# EAGLE design board (EAGLE 9.6.2)

## Sheet 1 of 5: Power
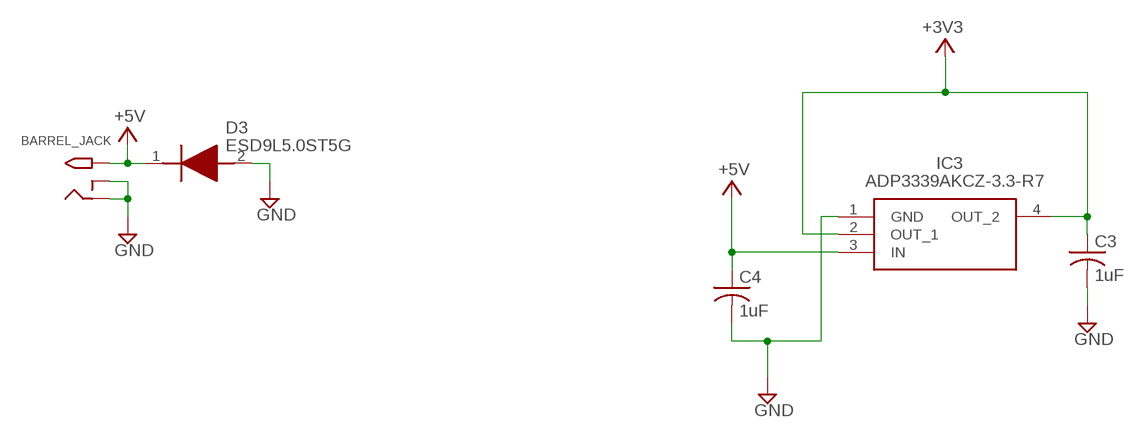
[diagram p0: schematic, sheet 1]

### Parts
BARREL_JACK  2.1MMJACKTHM  [PJ-102A]
C3  1uF  C-USC0402  [C0402]
C4  1uF  C-USC0402  [C0402]
D3  ESD9L5.0ST5G  [SODFL1006X40N]
IC3  ADP3339AKCZ-3.3-R7  [SOT230P700X180-4N]

### Nets
+3V3: C3.1 IC3.2(OUT_1) IC3.4(OUT_2) ; also sheet 3,5
+5V: BARREL_JACK.TIP C4.1 D3.1(K) IC3.3(IN) ; also sheet 3,4
GND: BARREL_JACK.RING BARREL_JACK.RING_SW C3.2 C4.2 D3.2(A) IC3.1(GND) ; also sheet 2,3,4,5

## Sheet 2 of 5: USB
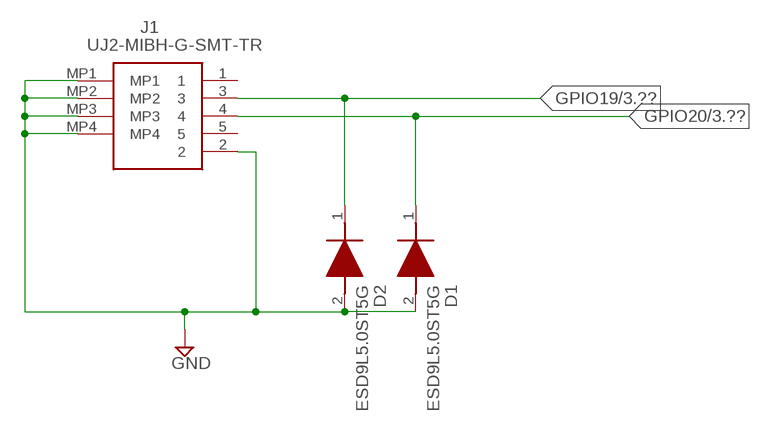
[diagram p1: schematic, sheet 2]

### Parts
D1  ESD9L5.0ST5G  [SODFL1006X40N]
D2  ESD9L5.0ST5G  [SODFL1006X40N]
J1  UJ2-MIBH-G-SMT-TR  [UJ2MIBHGSMTTR]

### Nets
GND: D1.2(A) D2.2(A) J1.2 J1.MP1 J1.MP2 J1.MP3 J1.MP4 ; also sheet 1,3,4,5
GPIO19: D2.1(K) J1.3 ; also sheet 3
GPIO20: D1.1(K) J1.4 ; also sheet 3
Unconnected: J1.1 J1.5

## Sheet 3 of 5: Controller
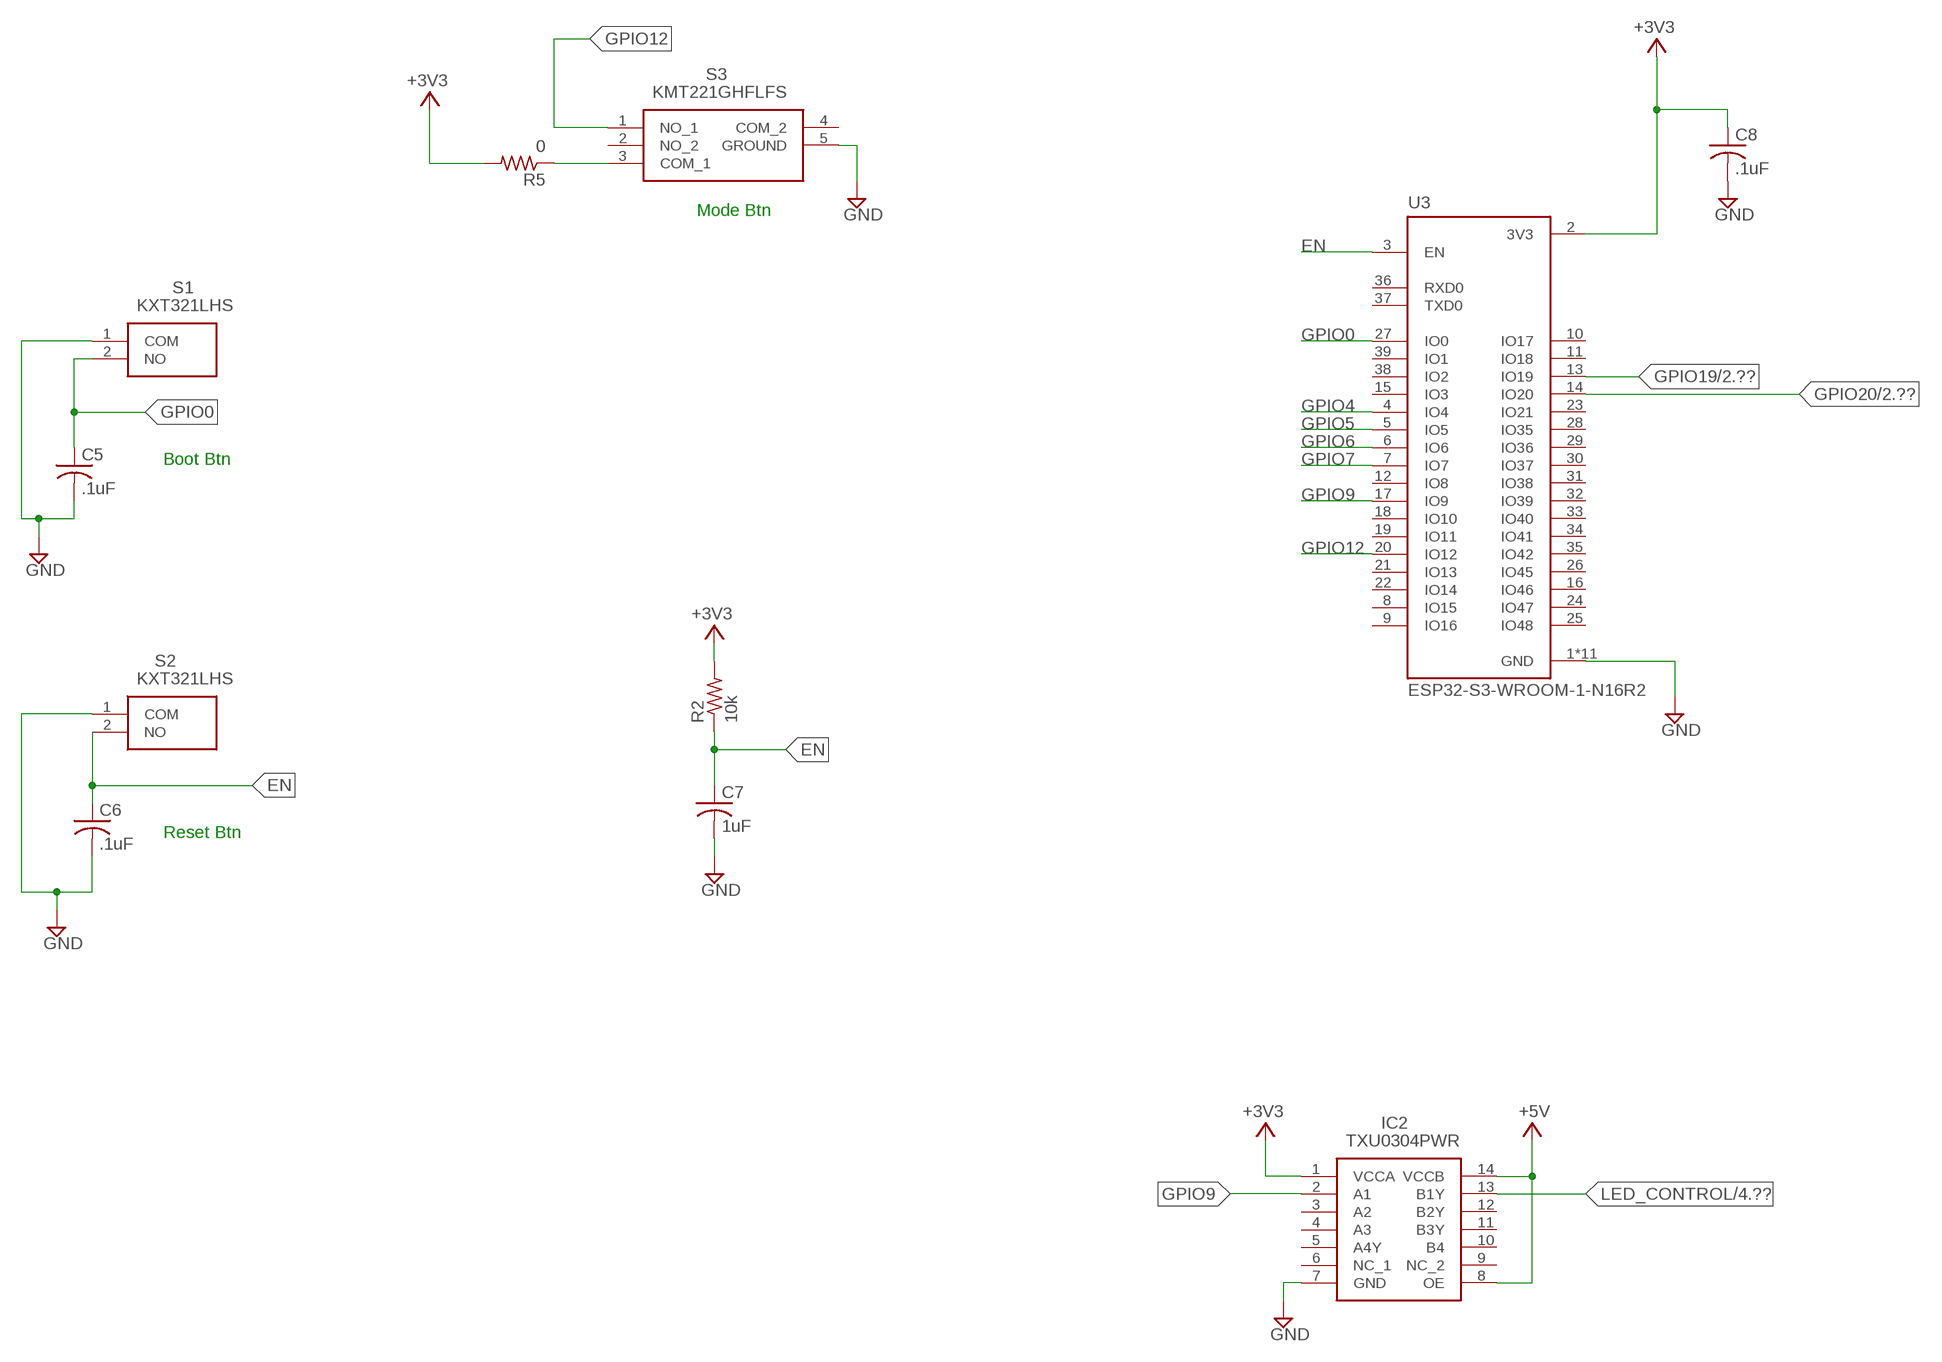
[diagram p2: schematic, sheet 3]

### Parts
C5  .1uF  C-USC0402  [C0402]
C6  .1uF  C-USC0402  [C0402]
C7  1uF  C-USC0402  [C0402]
C8  .1uF  C-USC0402  [C0402]
IC2  TXU0304PWR  [SOP65P640X120-14N]
R2  10k  R-US_R0402  [R0402]
R5  0  R-US_R0402  [R0402]
S1  KXT321LHS  [KXT321LHS]
S2  KXT321LHS  [KXT321LHS]
S3  KMT221GHFLFS  [KMT221GHFLFS]
U3  ESP32-S3-WROOM-1-N16R2  [XCVR_ESP32-S3-WROOM-1-N16R2]

### Nets
+3V3: C8.1 IC2.1(VCCA) R2.2 R5.2 U3.2(3V3) ; also sheet 1,5
+5V: IC2.8(OE) IC2.14(VCCB) ; also sheet 1,4
EN: C6.1 C7.1 R2.1 S2.2(NO) U3.3(EN)
GND: C5.2 C6.2 C7.2 C8.2 IC2.7(GND) S1.1(COM) S2.1(COM) S3.5(GROUND) U3.1(GND) U3.40(GND) U3.41_1(GND) U3.41_2(GND) U3.41_3(GND) U3.41_4(GND) U3.41_5(GND) U3.41_6(GND) U3.41_7(GND) U3.41_8(GND) U3.41_9(GND) ; also sheet 1,2,4,5
GPIO0: C5.1 S1.2(NO) U3.27(IO0)
GPIO4: U3.4(IO4) ; also sheet 5
GPIO5: U3.5(IO5) ; also sheet 5
GPIO6: U3.6(IO6) ; also sheet 5
GPIO7: U3.7(IO7) ; also sheet 5
GPIO9: IC2.2(A1) U3.17(IO9)
GPIO12: S3.1(NO_1) U3.20(IO12)
GPIO19: U3.13(IO19) ; also sheet 2
GPIO20: U3.14(IO20) ; also sheet 2
LED_CONTROL: IC2.13(B1Y) ; also sheet 4
N$16: R5.1 S3.3(COM_1)
Unconnected: IC2.3(A2) IC2.4(A3) IC2.5(A4Y) IC2.6(NC_1) IC2.9(NC_2) IC2.10(B4) IC2.11(B3Y) IC2.12(B2Y) S3.2(NO_2) S3.4(COM_2) U3.8(IO15) U3.9(IO16) U3.10(IO17) U3.11(IO18) U3.12(IO8) U3.15(IO3) U3.16(IO46) U3.18(IO10) U3.19(IO11) U3.21(IO13) U3.22(IO14) U3.23(IO21) U3.24(IO47) U3.25(IO48) U3.26(IO45) U3.28(IO35) U3.29(IO36) U3.30(IO37) U3.31(IO38) U3.32(IO39) U3.33(IO40) U3.34(IO41) U3.35(IO42) U3.36(RXD0) U3.37(TXD0) U3.38(IO2) U3.39(IO1)

### Notes on the sheet
- Mode Btn
- Boot Btn
- Reset Btn

## Sheet 4 of 5: LEDs
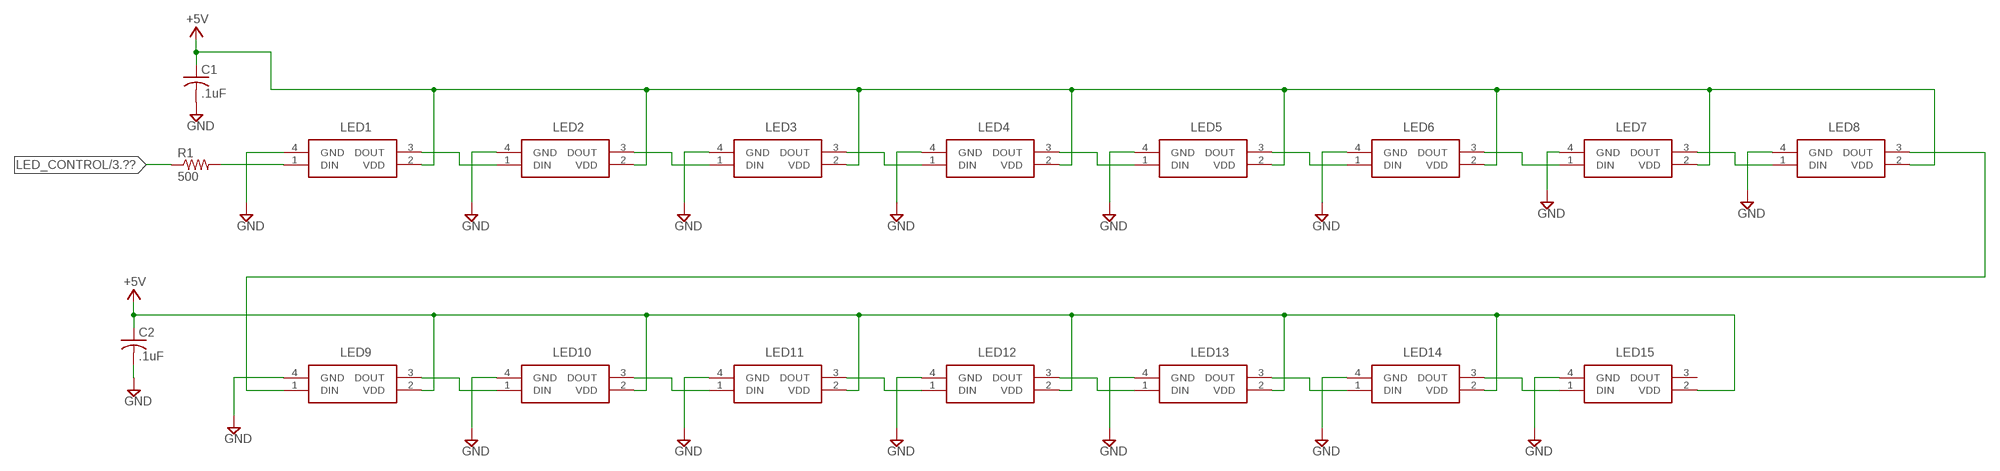
[diagram p3: schematic, sheet 4]

### Parts
C1  .1uF  C-USC0402  [C0402]
C2  .1uF  C-USC0402  [C0402]
LED1  4492__SK6805-EC_15_  [4492SK6805EC15]
LED2  4492__SK6805-EC_15_  [4492SK6805EC15]
LED3  4492__SK6805-EC_15_  [4492SK6805EC15]
LED4  4492__SK6805-EC_15_  [4492SK6805EC15]
LED5  4492__SK6805-EC_15_  [4492SK6805EC15]
LED6  4492__SK6805-EC_15_  [4492SK6805EC15]
LED7  4492__SK6805-EC_15_  [4492SK6805EC15]
LED8  4492__SK6805-EC_15_  [4492SK6805EC15]
LED9  4492__SK6805-EC_15_  [4492SK6805EC15]
LED10  4492__SK6805-EC_15_  [4492SK6805EC15]
LED11  4492__SK6805-EC_15_  [4492SK6805EC15]
LED12  4492__SK6805-EC_15_  [4492SK6805EC15]
LED13  4492__SK6805-EC_15_  [4492SK6805EC15]
LED14  4492__SK6805-EC_15_  [4492SK6805EC15]
LED15  4492__SK6805-EC_15_  [4492SK6805EC15]
R1  500  R-US_R0402  [R0402]

### Nets
+5V: C1.1 C2.1 LED1.2(VDD) LED2.2(VDD) LED3.2(VDD) LED4.2(VDD) LED5.2(VDD) LED6.2(VDD) LED7.2(VDD) LED8.2(VDD) LED9.2(VDD) LED10.2(VDD) LED11.2(VDD) LED12.2(VDD) LED13.2(VDD) LED14.2(VDD) LED15.2(VDD) ; also sheet 1,3
GND: C1.2 C2.2 LED1.4(GND) LED2.4(GND) LED3.4(GND) LED4.4(GND) LED5.4(GND) LED6.4(GND) LED7.4(GND) LED8.4(GND) LED9.4(GND) LED10.4(GND) LED11.4(GND) LED12.4(GND) LED13.4(GND) LED14.4(GND) LED15.4(GND) ; also sheet 1,2,3,5
LED_CONTROL: R1.1 ; also sheet 3
N$1: LED1.3(DOUT) LED2.1(DIN)
N$2: LED2.3(DOUT) LED3.1(DIN)
N$3: LED3.3(DOUT) LED4.1(DIN)
N$4: LED4.3(DOUT) LED5.1(DIN)
N$5: LED5.3(DOUT) LED6.1(DIN)
N$6: LED6.3(DOUT) LED7.1(DIN)
N$7: LED7.3(DOUT) LED8.1(DIN)
N$8: LED8.3(DOUT) LED9.1(DIN)
N$9: LED9.3(DOUT) LED10.1(DIN)
N$10: LED10.3(DOUT) LED11.1(DIN)
N$11: LED11.3(DOUT) LED12.1(DIN)
N$12: LED12.3(DOUT) LED13.1(DIN)
N$13: LED13.3(DOUT) LED14.1(DIN)
N$14: LED14.3(DOUT) LED15.1(DIN)
N$15: LED1.1(DIN) R1.2
Unconnected: LED15.3(DOUT)

## Sheet 5 of 5: 7-segment
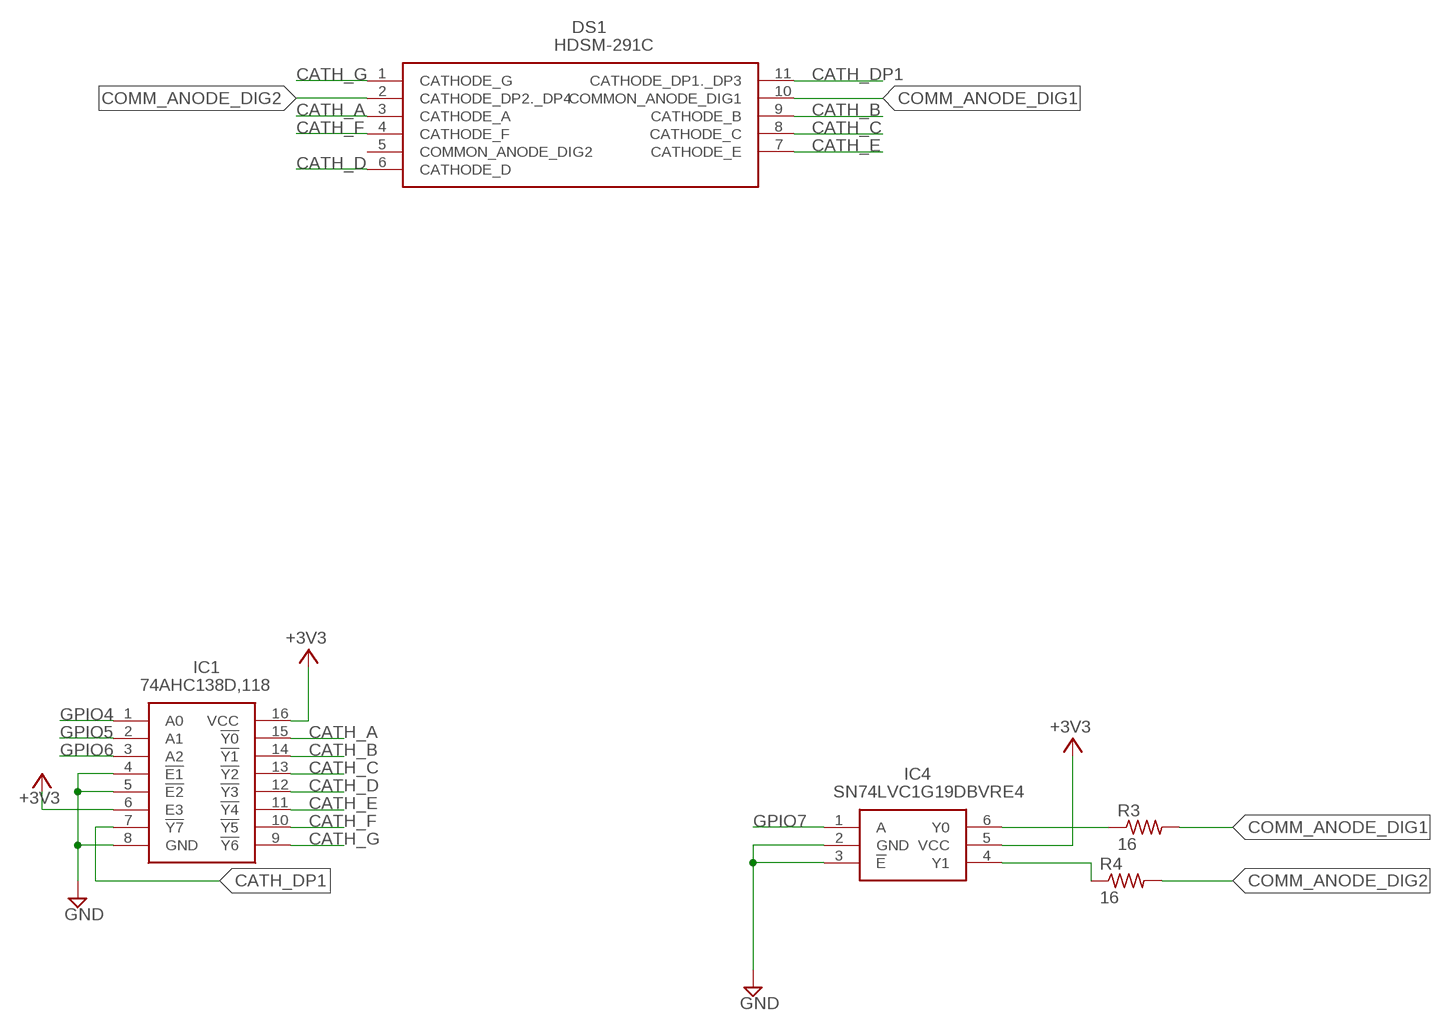
[diagram p4: schematic, sheet 5]

### Parts
DS1  HDSM-291C  [HDSM291C]
IC1  74AHC138D,118  [SOIC127P600X175-16N]
IC4  SN74LVC1G19DBVRE4  [SOT95P280X145-6N]
R3  16  R-US_R0402  [R0402]
R4  16  R-US_R0402  [R0402]

### Nets
+3V3: IC1.6(E3) IC1.16(VCC) IC4.5(VCC) ; also sheet 1,3
CATH_A: DS1.3(CATHODE_A) IC1.15(!Y0)
CATH_B: DS1.9(CATHODE_B) IC1.14(!Y1)
CATH_C: DS1.8(CATHODE_C) IC1.13(!Y2)
CATH_D: DS1.6(CATHODE_D) IC1.12(!Y3)
CATH_DP1: DS1.11(CATHODE_DP1._DP3) IC1.7(!Y7)
CATH_E: DS1.7(CATHODE_E) IC1.11(!Y4)
CATH_F: DS1.4(CATHODE_F) IC1.10(!Y5)
CATH_G: DS1.1(CATHODE_G) IC1.9(!Y6)
COMM_ANODE_DIG1: DS1.10(COMMON_ANODE_DIG1) R3.2
COMM_ANODE_DIG2: DS1.2(CATHODE_DP2._DP4) R4.2
GND: IC1.4(!E1) IC1.5(!E2) IC1.8(GND) IC4.2(GND) IC4.3(!E) ; also sheet 1,2,3,4
GPIO4: IC1.1(A0) ; also sheet 3
GPIO5: IC1.2(A1) ; also sheet 3
GPIO6: IC1.3(A2) ; also sheet 3
GPIO7: IC4.1(A) ; also sheet 3
N$19: IC4.6(Y0) R3.1
N$25: IC4.4(Y1) R4.1
Unconnected: DS1.5(COMMON_ANODE_DIG2)

## Library data of the parts
BARREL_JACK = adafruit:2.1MMJACK: 2.1mm x 5.5mm THM DC jack with internal switch. Digikey part #PJ-102A, 4UCON part #05537 2.1mm x 5.5mm SMT DC jack with internal switch. Digikey part #PJ-002A-SMT, 4UCON part #03267 By microbuilder.eu & adafruit.com
C1-C8 = adafruit:C-US: CAPACITOR, American symbol
D1-D3 = SamacSys_Parts:ESD9L5.0ST5G: Transient Voltage Suppressors ESD Protection Diodes with UltraLow Capacitance Source: Datasheet <http://www.onsemi.com/pub/Collateral/ESD9L-D.PDF>; DESCRIPTION: Transient Voltage Suppressors ESD Protection Diodes with UltraLow Capacitance; HEIGHT: 0.4mm; MANUFACTURER_NAME: onsemi; MANUFACTURER_PART_NUMBER: ESD9L5.0ST5G; MOUSER_PART_NUMBER: 863-ESD9L5.0ST5G; MOUSER_PRICE-STOCK: https://www.mouser.co.uk/ProductDetail/onsemi/ESD9L5.0ST5G?qs=lq5%252BOP7PS0%252BtbEEODUxZiA%3D%3D
DS1 = SamacSys_Parts:HDSM-291C: BROADCOM LIMITED - HDSM-291C - LED DISPLAY, SMD, DUAL, 7MM, RED, CA Source: Datasheet <https://www.mouser.co.uk/datasheet/2/678/AV02-0981EN_DS_HDSM-29xx_2019-04-18-1827889.pdf>; DESCRIPTION: BROADCOM LIMITED - HDSM-291C - LED DISPLAY, SMD, DUAL, 7MM, RED, CA; HEIGHT: 3.75mm; MANUFACTURER_NAME: Avago Technologies; MANUFACTURER_PART_NUMBER: HDSM-291C; MOUSER_PART_NUMBER: 630-HDSM-291C; MOUSER_PRICE-STOCK: https://www.mouser.co.uk/ProductDetail/Broadcom-Avago/HDSM-291C?qs=NCV3C3qdz%2FCIP43YVdyTXA%3D%3D
IC1 = SamacSys_Parts:74AHC138D,118: 74AHC(T)138 - 3-to-8 line decoder/demultiplexer; inverting@en-us Source: Datasheet <https://assets.nexperia.com/documents/data-sheet/74AHC_AHCT138.pdf>; DESCRIPTION: 74AHC(T)138 - 3-to-8 line decoder/demultiplexer; inverting@en-us; HEIGHT: 1.75mm; MANUFACTURER_NAME: Nexperia; MANUFACTURER_PART_NUMBER: 74AHC138D,118; MOUSER_PART_NUMBER: 771-74AHC138D-T; MOUSER_PRICE-STOCK: https://www.mouser.co.uk/ProductDetail/Nexperia/74AHC138D118?qs=P62ublwmbi%252BfNK%252BP%2F9EeQw%3D%3D
IC2 = SamacSys_Parts:TXU0304PWR: Translation - Voltage Levels Four channel unidirectional level shifter Source: Datasheet <https://www.ti.com/lit/ds/symlink/txu0304.pdf?ts=1627717511667&ref_url=https%3A%2F%2Fwww.ti.com%2Fproduct%2FTXU0304>; DESCRIPTION: Translation - Voltage Levels Four channel unidirectional level shifter; HEIGHT: 1.2mm; MANUFACTURER_NAME: Texas Instruments; MANUFACTURER_PART_NUMBER: TXU0304PWR; MOUSER_PART_NUMBER: 595-TXU0304PWR; MOUSER_PRICE-STOCK: https://www.mouser.co.uk/ProductDetail/Texas-Instruments/TXU0304PWR?qs=QNEnbhJQKvZVYXIKZoXs0A%3D%3D
IC3 = SamacSys_Parts:ADP3339AKCZ-3.3-R7: ADP3339AKCZ-3.3-R7, Low Dropout Voltage Regulator, 1.5A, 3.3 V +/-0.9%, 2.8 6 Vin, 4-Pin SOT-223 Source: Datasheet <http://www.analog.com/static/imported-files/data_sheets/ADP3339.pdf>; DESCRIPTION: ADP3339AKCZ-3.3-R7, Low Dropout Voltage Regulator, 1.5A, 3.3 V +/-0.9%, 2.8 6 Vin, 4-Pin SOT-223; HEIGHT: 1.8mm; MANUFACTURER_NAME: Analog Devices; MANUFACTURER_PART_NUMBER: ADP3339AKCZ-3.3-R7; MOUSER_PART_NUMBER: 584-ADP3339AKCZ3.3R7; MOUSER_PRICE-STOCK: https://www.mouser.co.uk/ProductDetail/Analog-Devices/ADP3339AKCZ-3.3-R7?qs=WIvQP4zGanhoxUECVzDnsA%3D%3D
IC4 = SamacSys_Parts:SN74LVC1G19DBVRE4: Encoders, Decoders, Multiplexers & Demultiplexers 1 of 2 Decoder Demultiplexer Source: Datasheet <https://www.ti.com/lit/gpn/SN74LVC1G19>; DESCRIPTION: Encoders, Decoders, Multiplexers & Demultiplexers 1 of 2 Decoder Demultiplexer; HEIGHT: 1.45mm; MANUFACTURER_NAME: Texas Instruments; MANUFACTURER_PART_NUMBER: SN74LVC1G19DBVRE4; MOUSER_PART_NUMBER: 595-74LVC1G19DBVRE4; MOUSER_PRICE-STOCK: https://www.mouser.co.uk/ProductDetail/Texas-Instruments/SN74LVC1G19DBVRE4?qs=pajgIaoyDUhZzpoVmzDWwA%3D%3D
J1 = SamacSys_Parts:UJ2-MIBH-G-SMT-TR: USB Connectors Source: Datasheet; DESCRIPTION: USB Connectors; HEIGHT: 3.15mm; MANUFACTURER_NAME: CUI Inc.; MANUFACTURER_PART_NUMBER: UJ2-MIBH-G-SMT-TR; MOUSER_PART_NUMBER: 490-UJ2-MIBH-G-SMTTR; MOUSER_PRICE-STOCK: https://www.mouser.co.uk/ProductDetail/CUI-Devices/UJ2-MIBH-G-SMT-TR?qs=IS%252B4QmGtzzpvS1XQusp0iA%3D%3D
LED1-LED15 = SamacSys_Parts:4492__SK6805-EC_15_: Addressable Lighting series 10 LED Discrete - Red, Green, Blue (RGB) 1.50mm L x 1.50mm W Source: Datasheet <https://cdn-shop.adafruit.com/product-files/4492/Datasheet.pdf>; DESCRIPTION: Addressable Lighting series 10 LED Discrete - Red, Green, Blue (RGB) 1.50mm L x 1.50mm W; HEIGHT: 0.75mm; MANUFACTURER_NAME: Adafruit; MANUFACTURER_PART_NUMBER: 4492 (SK6805-EC 15)
R1-R5 = adafruit:R-US_: RESISTOR, American symbol
S1 S2 = SamacSys_Parts:KXT321LHS: Tactile Switches 20mA 15VDC 160gf 0.6mm SPST NO SMT Source: Datasheet <https://www.arrow.com/en/products/kxt321lhs/ck>; DESCRIPTION: Tactile Switches 20mA 15VDC 160gf 0.6mm SPST NO SMT; HEIGHT: 0.7mm; MANUFACTURER_NAME: C & K COMPONENTS; MANUFACTURER_PART_NUMBER: KXT321LHS; MOUSER_PART_NUMBER: 611-KXT321LHS; MOUSER_PRICE-STOCK: https://www.mouser.co.uk/ProductDetail/CK/KXT321LHS?qs=%2FQ2qp2Z%2FWFztp%2FMwKtSHuA%3D%3D
S3 = SamacSys_Parts:KMT221GHFLFS: Tactile Switches SPST-NO, Off-Mom,SMT Tact Source: Datasheet <https://www.arrow.com/en/products/kmt221ghflfs/ck>; DESCRIPTION: Tactile Switches SPST-NO, Off-Mom,SMT Tact; HEIGHT: 0.82mm; MANUFACTURER_NAME: C & K COMPONENTS; MANUFACTURER_PART_NUMBER: KMT221GHFLFS; MOUSER_PART_NUMBER: 611-KMT221GHFLFS; MOUSER_PRICE-STOCK: https://www.mouser.co.uk/ProductDetail/CK/KMT221GHFLFS?qs=qoLfgwe54911fWMAni3k4g%3D%3D
U3 = ESP32-S3-WROOM-1-N16R2:ESP32-S3-WROOM-1-N16R2: Check availability <https://pricing.snapeda.com/parts/ESP32-S3-WROOM-1-N16R2/Espressif%20Systems/view-part?ref=eda>; AVAILABILITY: In Stock; DESCRIPTION: Bluetooth, WiFi 802.11b/g/n, Bluetooth v5.0 Transceiver Module 2.4GHz PCB Trace Surface Mount; MF: Espressif Systems; MP: ESP32-S3-WROOM-1-N16R2; PACKAGE: None; PRICE: None; PURCHASE-URL: https://pricing.snapeda.com/search/part/ESP32-S3-WROOM-1-N16R2/?ref=eda

## Net classes
1 diff pair: width 0.17 mm, clearance 0.22 mm to class 0, clearance 0.203 mm

## Board
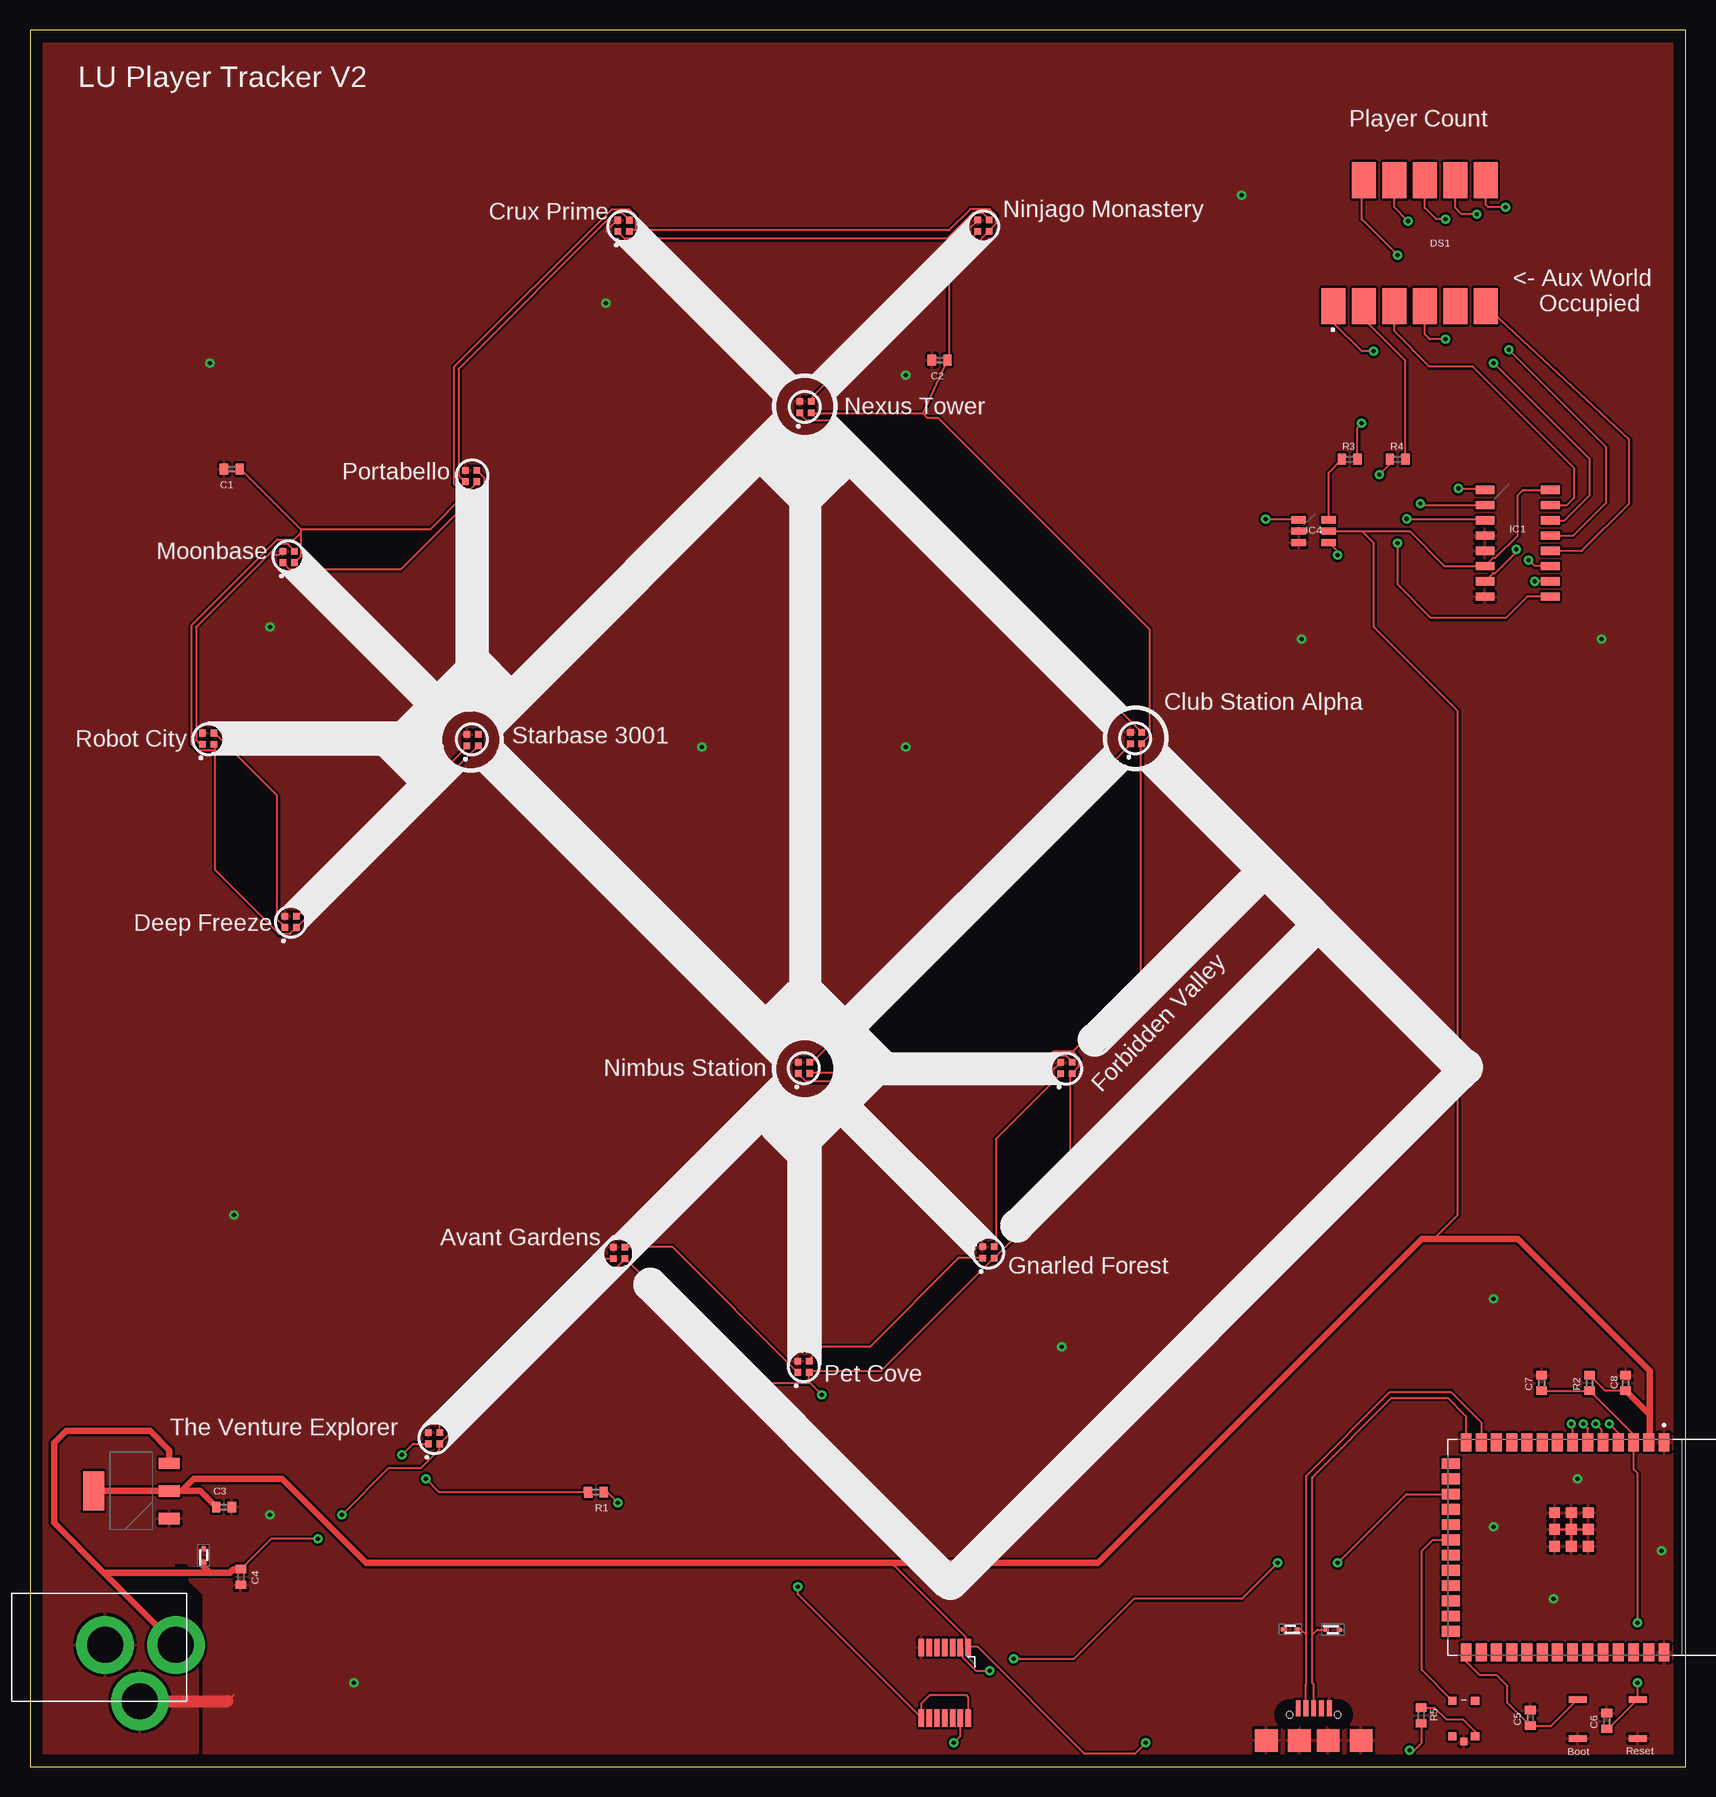
[diagram p5: board, top side]
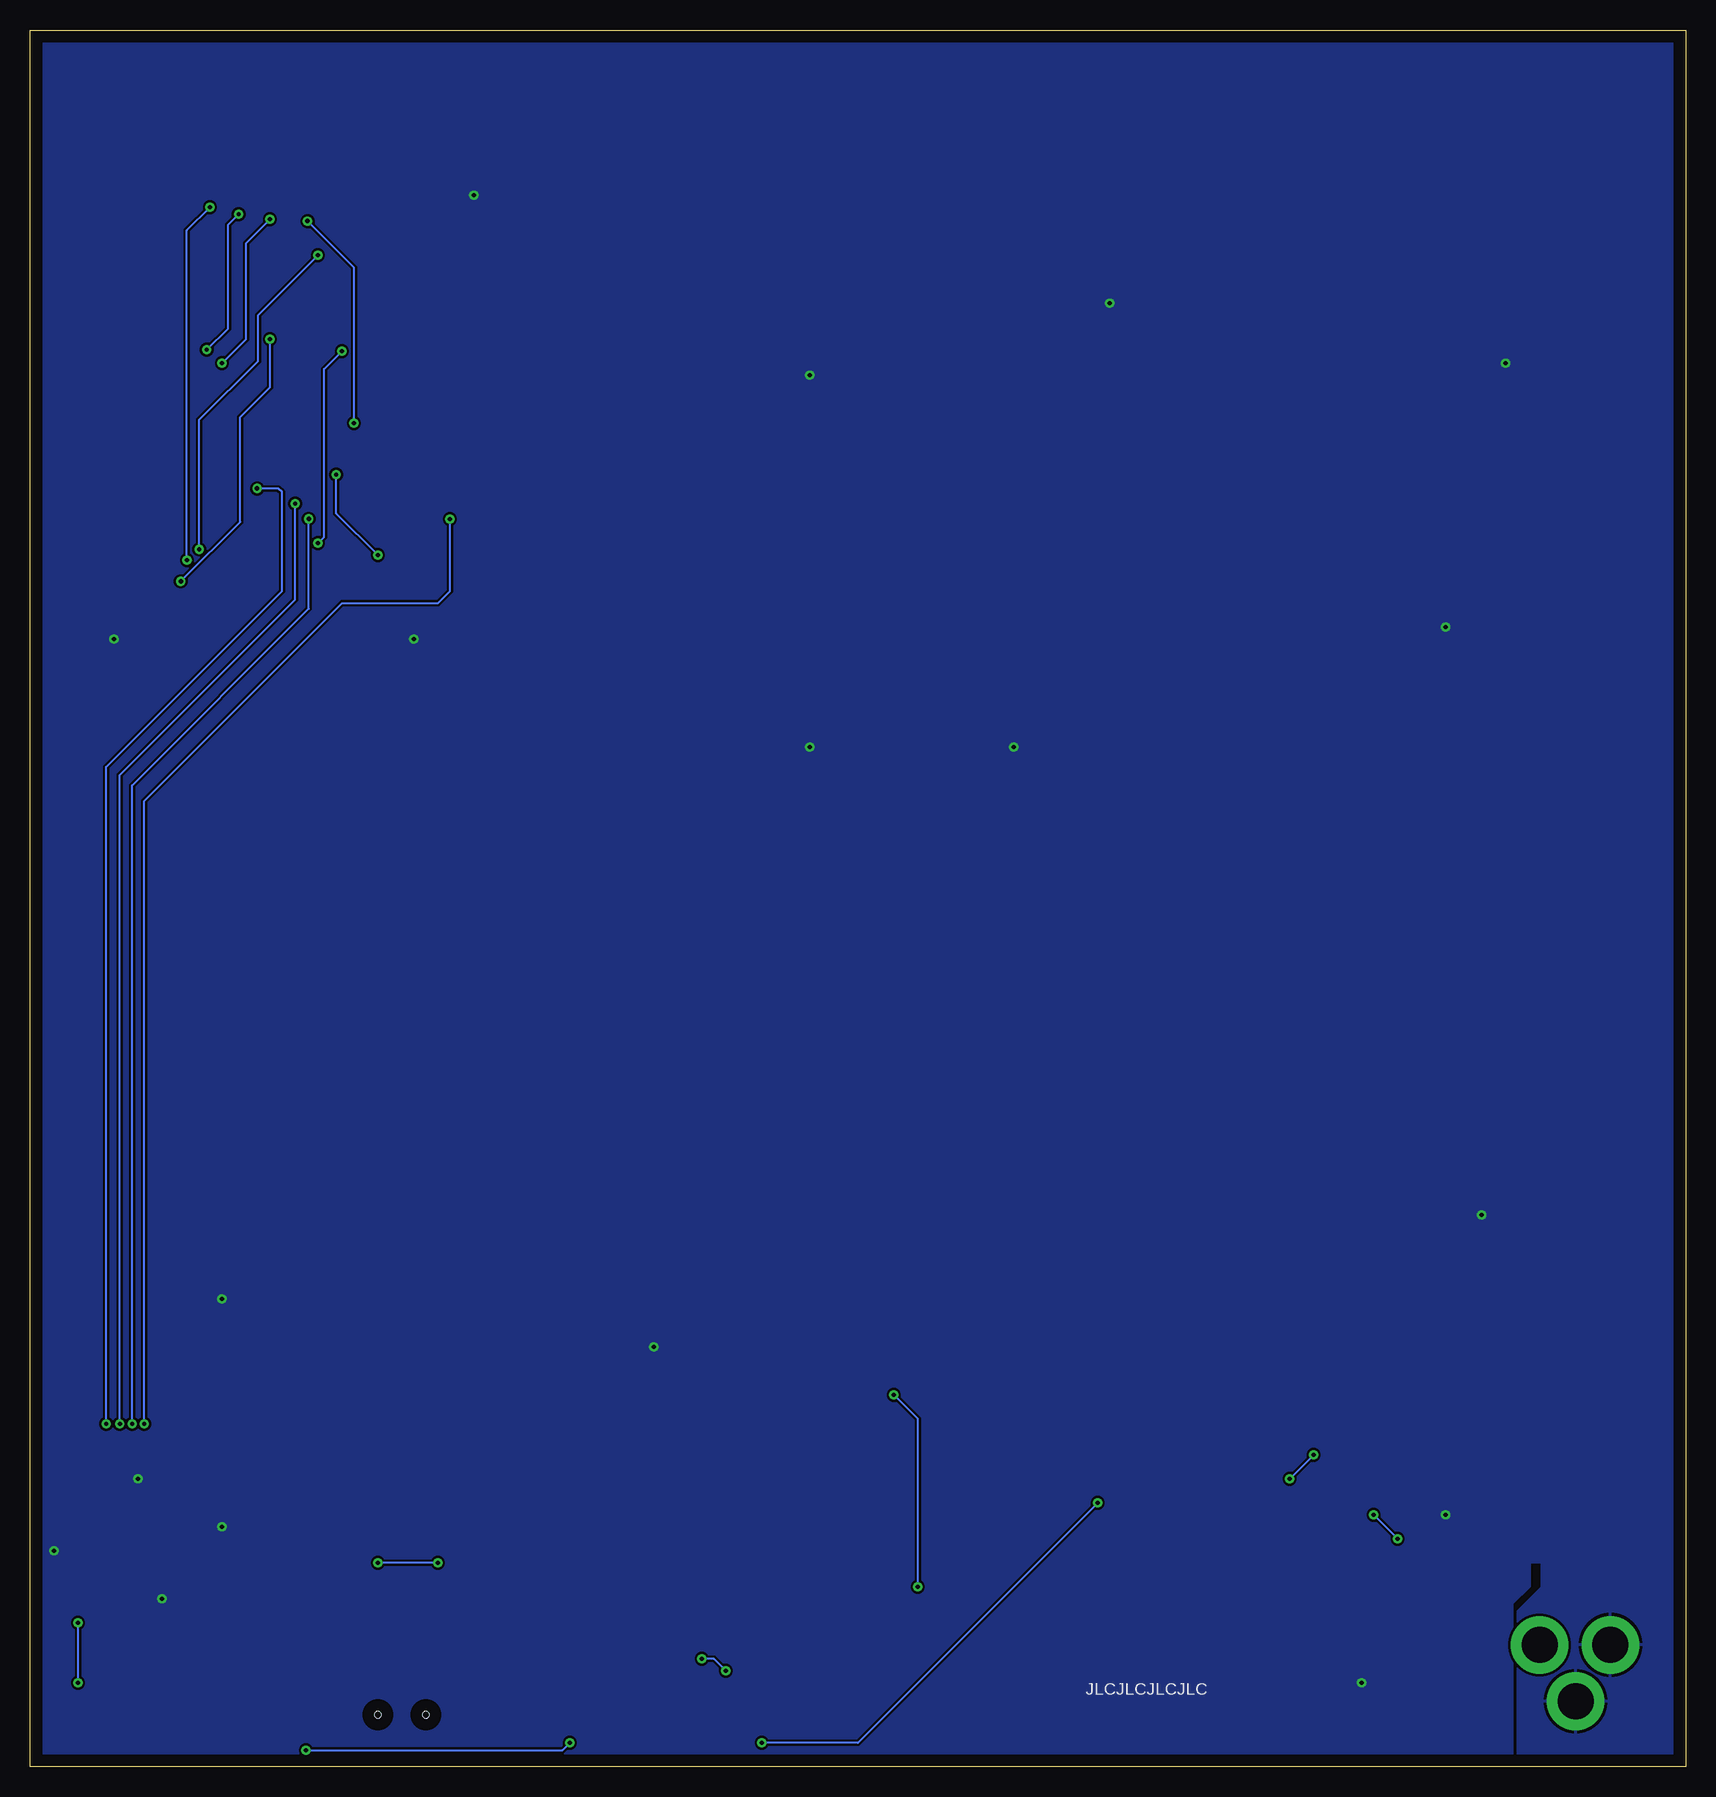
[diagram p6: board, bottom side, seen from below]

Size 138 x 144.78 mm. Coordinates in mm from the lower left corner, seen from the top.
Outline: 0,0 138,0 138,144.78 0,144.78 0,0
Copper layers (1*16): Top 0.035mm / dielectric 1.5mm / Bottom 0.035mm
Design rules "default *": minimum track width 6mil, minimum drill 0.35mm, track to track 8mil, track to pad 6mil, pad to pad 6mil, via to via 6mil, smd to smd 6mil, copper to edge 40mil, drill to drill 6mil, minimum pad ring 10mil, minimum via ring 8mil, stop-mask expansion 4mil, vias tented up to drill 0mil, thermal gap 10mil

### Footprints (pad centres in the part's own frame; a part is rotated, then mirrored left to right if it is on the bottom)
PJ-102A = drill 3 pad 4.8: RING 0.1,-3.39; RING_SW -4.6,-6.29; TIP 0.1,-9.29
C0402 = smd 0.7 x 0.9: 1 -0.65,0; 2 0.65,0
SODFL1006X40N = smd 0.43 x 0.32: 1 -0.55,0; 2 0.55,0
HDSM291C = smd 2 x 3: 1 -6.35,-5.25; 2 -3.81,-5.25; 3 -1.27,-5.25; 4 1.27,-5.25; 5 3.81,-5.25; 6 6.35,-5.25; 7 6.35,5.25; 8 3.81,5.25; 9 1.27,5.25; 10 -1.27,5.25; 11 -3.81,5.25
SOIC127P600X175-16N = smd 1.55 x 0.7: 1 -2.725,4.445; 2 -2.725,3.175; 3 -2.725,1.905; 4 -2.725,0.635; 5 -2.725,-0.635; 6 -2.725,-1.905; 7 -2.725,-3.175; 8 -2.725,-4.445; 9 2.725,-4.445; 10 2.725,-3.175; 11 2.725,-1.905; 12 2.725,-0.635; 13 2.725,0.635; 14 2.725,1.905; 15 2.725,3.175; 16 2.725,4.445
SOP65P640X120-14N = smd 1.475 x 0.45: 1 -2.938,1.95; 2 -2.938,1.3; 3 -2.938,0.65; 4 -2.938,0; 5 -2.938,-0.65; 6 -2.938,-1.3; 7 -2.938,-1.95; 8 2.938,-1.95; 9 2.938,-1.3; 10 2.938,-0.65; 11 2.938,0; 12 2.938,0.65; 13 2.938,1.3; 14 2.938,1.95
SOT230P700X180-4N = smd 1.75 x 0.95: 1 -3.15,2.3; 2 -3.15,0; 3 -3.15,-2.3 | smd 1.75 x 3.25: 4 3.15,0
SOT95P280X145-6N = smd 1.2 x 0.6: 1 -1.25,0.95; 2 -1.25,0; 3 -1.25,-0.95; 4 1.25,-0.95; 5 1.25,0; 6 1.25,0.95
UJ2MIBHGSMTTR = smd 0.4 x 1.35: 1 -1.3,2.64; 2 1.3,2.64; 3 -0.65,2.64; 4 0,2.64; 5 0.65,2.64 | smd 1.9 x 1.9: MP1 -3.95,-0.035; MP2 -1.2,-0.035; MP3 1.2,-0.035; MP4 3.95,-0.035 | hole 0.55: -2,2.115; 2,2.115
4492SK6805EC15 = smd 0.55 x 0.55: 1 -0.475,-0.475; 2 0.475,-0.475; 3 0.475,0.475; 4 -0.475,0.475
R0402 = smd 0.7 x 0.9: 1 -0.65,0; 2 0.65,0
KXT321LHS = smd 0.55 x 1.5: 1 -1.625,0; 2 1.625,0
KMT221GHFLFS = smd 0.65 x 0.7: 1 -1.475,-0.95; 2 1.475,-0.95; 3 1.475,0.95; 4 -1.475,0.95 | smd 0.6 x 0.6: 5 1.925,0
XCVR_ESP32-S3-WROOM-1-N16R2 = smd 1.5 x 0.9: 1 -8.75,5.26; 2 -8.75,3.99; 3 -8.75,2.72; 4 -8.75,1.45; 5 -8.75,0.18; 6 -8.75,-1.09; 7 -8.75,-2.36; 8 -8.75,-3.63; 9 -8.75,-4.9; 10 -8.75,-6.17; 11 -8.75,-7.44; 12 -8.75,-8.71; 13 -8.75,-9.98; 14 -8.75,-11.25; 27 8.75,-11.25; 28 8.75,-9.98; 29 8.75,-8.71; 30 8.75,-7.44; 31 8.75,-6.17; 32 8.75,-4.9; 33 8.75,-3.63; 34 8.75,-2.36; 35 8.75,-1.09; 36 8.75,0.18; 37 8.75,1.45; 38 8.75,2.72; 39 8.75,3.99; 40 8.75,5.26 | smd 0.9 x 1.5: 15 -6.985,-12.5; 16 -5.715,-12.5; 17 -4.445,-12.5; 18 -3.175,-12.5; 19 -1.905,-12.5; 20 -0.635,-12.5; 21 0.635,-12.5; 22 1.905,-12.5; 23 3.175,-12.5; 24 4.445,-12.5; 25 5.715,-12.5; 26 6.985,-12.5 | smd 0.9 x 0.9: 41_1 -1.5,-2.46; 41_2 -2.9,-2.46; 41_3 -0.1,-2.46; 41_4 -2.9,-3.86; 41_5 -1.5,-3.86; 41_6 -0.1,-3.86; 41_7 -2.9,-1.06; 41_8 -1.5,-1.06; 41_9 -0.1,-1.06

### Placement (x,y rotation side)
BARREL_JACK  2.87,10.07 90 top
C1  16.83,108.18 180 top
C2  75.83,117.26 180 top
C3  16.17,21.66 0 top
C4  17.58,15.83 270 top
C5  125.06,4.08 90 top
C6  131.44,3.83 90 top
C7  126,32 90 top
C8  133,32 90 top
D1  108.61,11.43 0 top
D2  105.05,11.47 180 top
D3  14.47,17.64 90 top
DS1  115,127 0 top
IC1  124,102 0 top
IC2  76.25,7.02 270 top
IC3  8.46,23 180 top
IC4  107,103 0 top
J1  107,2.24 0 top
LED1  33.69,27.4 0 top
LED2  49.11,42.85 0 top
LED3  64.47,33.36 0 top
LED4  79.88,42.88 0 top
LED5  86.39,58.26 0 top
LED6  64.52,58.28 0 top
LED7  92.2,85.77 0 top
LED8  64.65,113.35 0 top
LED9  79.47,128.46 0 top
LED10  49.48,128.45 0 top
LED11  36.77,107.61 0 top
LED12  21.55,100.86 0 top
LED13  14.85,85.7 0 top
LED14  21.74,70.44 0 top
LED15  36.9,85.6 0 top
R1  47.17,22.9 180.7 top
R2  130,32 90 top
R3  110,109 0 top
R4  114,109 0 top
R5  115.96,4.28 270 top
S1  129,4 90 top
S2  134,4 90 top
S3  119.52,4.03 270 top
U3  130.95,18.29 270 top

### Tracks (layer width: path | path; a pad name or v marks a point on that pad's centre or on a via)
+3V3  (via drill 0.35)
  Top 0.152: 135,27.1 U3.2 | 72,17 72,16.79 78,10.79 78,10.15 IC2.1 78.24,10 79,10 87.91,1.09 92.09,1.09 v93,2 | C8.1 131.3,31.35 R2.2 | IC4.5 111,103 | 111,103 115,103 117.91,100.09 IC1.6 121.97,100.79 122.14,100.79 124,102.64 124,106 124.44,106.44 IC1.16 | 111,103 112,102 112,95 119,88 119,46 117,44 | v115,1.39 115.39,1.39 116,2 116,3.6 R5.2
  Top 0.525: 135,29.35 135,33 124,44 117,44 116,44 89,17 72,17 28,17 21,24 13.65,24 12.65,23 IC3.2 | 135,29.35 135,27.1 | C8.1 135,29.35 | IC3.2 IC3.4 | IC3.2 14.18,23 C3.1
  Bottom 0.152: v115,1.39 93.61,1.39 v93,2
+5V  (via drill 0.35)
  Top 0.152: v24,19 20.1,19 C4.1 | v26,21 29.91,24.91 32.59,24.91 34.16,26.48 LED1.2 49.59,42.35 LED2.2 59.96,32 65,32 | v64,15 64,14.38 IC2.8 74.3,5.3 75,6 78,6 78.2,5.8 IC2.14 | v66,31 65,32 | 65,32 64.95,32.05 LED3.2 65.07,33 70.95,33 LED4.2 80.52,42.56 86.74,48.78 86.74,57.67 LED5.2 86.92,57.85 87.45,58.38 87.45,59.1 86.92,59.63 | 86.92,59.63 85.32,59.63 83.54,57.85 65.05,57.85 LED6.2 | 86.92,59.63 92.61,65.32 92.61,85.23 LED7.2 92.79,85.41 93.32,85.94 93.32,94.83 75.72,112.44 74.83,112.44 74.47,112.79 74.43,112.79 | 74.43,112.79 65.23,112.79 LED8.2 | 74.43,112.79 C2.1 76.61,117.33 76.61,124.7 79.81,127.91 LED9.2 79.98,128.08 80.52,128.62 80.52,129.33 79.98,129.86 78.38,129.86 76.61,128.08 50.47,128.08 | 50.47,128.08 50.11,128.08 LED10.2 | 22.55,103.19 22.55,102.89 22.55,102.86 | 22.55,102.86 22.55,102.3 22.55,100.88 22.2,100.52 LED12.2 | 22.55,103.19 17.58,108.17 C1.1 | 36.25,106.04 33.4,103.19 22.55,103.19 | 36.25,106.04 37.13,106.92 37.13,107.1 LED11.2 | 15.44,84.7 15.44,74.74 20.78,69.41 21.67,69.41 22.2,69.94 LED14.2 22.38,70.12 37.31,85.06 LED15.2 | 15.44,84.7 15.44,85.06 LED13.2 | 15.44,84.7 14.02,84.7 13.49,85.23 13.49,95.19 20.6,102.3 22,102.3 22.55,102.86 | 50.47,128.08 50.47,129.33 49.94,129.86 48.51,129.86 35.36,116.7 35.36,106.92 36.25,106.04
  Top 0.525: 15,16.16 6.16,16.16 | 15,16.16 16.65,16.16 16.97,16.48 C4.1 | IC3.3 11.61,26.39 10,28 3,28 2,27 2,20.33 6.16,16.16 | 15,16.16 14.47,16.69 D3.1 | BARREL_JACK.TIP 6.16,16.16
  Bottom 0.152: v24,19 v26,21 | v64,15 64,29 v66,31
CATH_A
  Top 0.152: IC1.15 128.09,105.17 128.73,105.81 128.73,108.27 120.27,116.73 116.66,116.73 113.73,119.66 DS1.3
CATH_B  (via drill 0.35)
  Top 0.152: IC1.14 127.91,103.91 130,106 130,109 v122,117 | v118,129 117.22,129 116.27,129.95 DS1.9
  Bottom 0.152: v122,117 120,119 120,127 v118,129
CATH_C  (via drill 0.35)
  Top 0.152: IC1.13 128.63,102.64 131.39,105.39 131.39,110 v123.27,118.13 | v120.6,129.43 119.33,129.43 118.81,129.95 DS1.8
  Bottom 0.152: v123.27,118.13 121.49,119.9 121.49,128.54 v120.6,129.43
CATH_D
  Top 0.152: IC1.12 129.37,101.36 133.3,105.3 133.3,110.65 DS1.6
CATH_DP1  (via drill 0.35)
  Top 0.152: IC1.7 121.97,99.52 122.14,99.52 123.9,101.27 v123.9,101.49 | v114,126 111,129 111,132.06 DS1.11
  Bottom 0.152: v123.9,101.49 123.9,112.28 119,117.19 119,121 v114,126
CATH_E  (via drill 0.35)
  Top 0.152: IC1.11 125.42,100.09 v124.92,100.6 | v123,130 121.55,130 121.35,130.2 DS1.7
  Bottom 0.152: v124.92,100.6 124.92,128.08 v123,130
CATH_F  (via drill 0.35)
  Top 0.152: IC1.10 v125.43,98.83 v125.42,98.82 | v118,119 116.68,119 116.27,119.41 DS1.4
  Bottom 0.152: v125.42,98.82 120.47,103.78 120.47,112.53 118,115 v118,119
CATH_G  (via drill 0.35)
  Top 0.152: IC1.9 124.79,97.56 123.01,95.77 116.79,95.77 114,98.56 v114,102 | v112,118 111,118 108.65,120.35 DS1.1
  Bottom 0.152: v114,102 113.49,102.51 113.49,116.51 v112,118
COMM_ANODE_DIG1  (via drill 0.35)
  Top 0.152: R3.2 110.65,111.65 v111,112 | v114.87,128.86 113.73,130 DS1.10
  Bottom 0.152: v111,112 111,124.98 v114.87,128.86
COMM_ANODE_DIG2
  Top 0.152: R4.2 114.65,117.22 111.19,120.68 DS1.2
EN  (via drill 0.35)
  Top 0.152: C6.1 131.55,3.18 S2.2 v134,7 | C7.1 R2.1 133.67,27.68 U3.3 133.67,24.79 134,24.46 v134,12
  Bottom 0.152: v134,7 v134,12
GND  (via drill 0.35)
  Top 0.152: 16.47,5.47 17,6 | LED9.4 78.06,128 78,128 | LED10.4 48.93,128.93 48,128 | LED12.4 20.74,101 20.33,101 20.17,100.83 | LED5.4 85.18,58 85,58 | 127.21,19.79 U3.41_5 U3.41_1 | U3.41_1 U3.41_8 | U3.41_1 U3.41_2 | U3.41_1 U3.41_3
  Top 1.016: BARREL_JACK.RING_SW 16.47,5.47
  other vias: 73,116 48,122 15,117 20,95 86,35 122,39 56,85 17,46 27,7 20,21 122,20 127,14 129,24 136,18 101,131 106,94 131,94 73,85
  pour Top: 5,146 -1,146 -2,145 -2,-2 16,-2 15,-1 14,-1 14,14 13,15 13,16 12,16 12,17 13,17 13.28,16.72 13.28,15.51 14.43,14.37 14.43,-0.36 15.44,-0.36 17,-1.92 17,-2 140,-2 141,-1 141,145 139,147 6,147
  pour Bottom: 138,146 -1,146 -1,-1 0,-2 13,-2 14,-1 14,13 12,15 12,17 13,17 13,15 14.43,13.57 14.43,-0.49 14.94,-1 139,-1 141,1 141,143
GPIO0
  Top 0.152: U3.27 119.7,8.79 120.85,7.64 122.25,7.64 123.14,6.75 123.14,5.35 C5.1 126.81,3.43 S1.2
GPIO4  (via drill 0.35)
  Top 0.152: U3.4 132.4,27.84 v131.65,28.59 | v119.08,106.57 121.15,106.57 IC1.1
  Bottom 0.152: v131.65,28.59 131.65,83.35 117,98 117,106.27 117.3,106.57 v119.08,106.57
GPIO5  (via drill 0.35)
  Top 0.152: U3.5 131,27.17 131,28.1 v130.5,28.59 | v115.9,105.3 116.02,105.17 IC1.2
  Bottom 0.152: v130.5,28.59 130.5,82.69 115.9,97.3 v115.9,105.3
GPIO6  (via drill 0.35)
  Top 0.152: U3.6 129.86,28.22 v129.49,28.59 | v114.76,104.03 121.15,104.03 IC1.3
  Bottom 0.152: v129.49,28.59 129.49,81.8 114.76,96.54 v114.76,104.03
GPIO7  (via drill 0.35)
  Top 0.152: U3.7 128.59,28.47 v128.47,28.59 | v103,104 105.7,104 IC4.1
  Bottom 0.152: v128.47,28.59 128.47,80.53 112,97 104,97 103,98 v103,104
GPIO9  (via drill 0.35)
  Top 0.152: IC2.2 77.75,9.76 77.75,9.13 78.87,8 v80,8 | v82,9 87,9 92,14 101,14 v104,17 | v109,17 114.73,22.73 U3.17
  Bottom 0.152: v80,8 81,9 v82,9 | v104,17 v109,17
GPIO12
  Top 0.152: S3.1 116,8.07 116,18 116.92,18.93 U3.20
GPIO19
  Top 0.152: J1.3 106.35,6.85 106.38,6.87 106.38,11 | U3.13 120.97,28.73 118.44,31.26 113.36,31.26 106.38,24.27 106.38,11 | 106.38,11 105.91,11.47 D2.1
GPIO20
  Top 0.152: J1.4 107,6.88 106.88,7 106.88,11 | 106.88,11 106.88,24.15 113.49,30.75 118.19,30.75 119.7,29.24 U3.14 | 106.88,11 107.31,11.43 D1.1
LED_CONTROL  (via drill 0.35)
  Top 0.152: R1.1 48.09,22.91 v49,22 | v77,2 77.55,2.55 IC2.13
  Bottom 0.152: v49,22 69,2 v77,2
N$1
  Top 0.152: LED1.3 34.16,28.84 34,29 34,29.5 46.88,42.38 LED2.1
N$2
  Top 0.152: LED3.1 53.55,43.33 LED2.3
N$3
  Top 0.152: LED4.1 77.41,42.41 70,35 66,35 64.95,33.95 LED3.3
N$4
  Top 0.152: LED4.3 80.52,43.45 80.52,52.34 85.85,57.67 LED5.1
N$5
  Top 0.152: LED6.1 64.16,57.67 64.69,57.14 83.36,57.14 85.5,59.27 86.38,59.27 86.92,58.74 LED5.3
N$6
  Top 0.152: LED6.3 65.05,58.92 65.41,58.92 91.72,85.23 LED7.1
N$7
  Top 0.152: LED7.3 92.61,86.3 66.65,112.26 64.69,112.26 64.16,112.79 LED8.1
N$8
  Top 0.152: LED8.3 65.23,113.86 65.23,114.21 78.92,127.91 LED9.1
N$9
  Top 0.152: LED10.1 49.05,127.91 49.58,127.37 76.43,127.37 78.56,129.5 79.45,129.5 79.98,128.97 LED9.3
N$10
  Top 0.152: LED11.1 36.25,107.28 36.07,107.28 35.71,107.64 35.71,116.53 48.69,129.5 49.4,129.5 49.94,128.97 LED10.3
N$11
  Top 0.152: LED12.1 21.13,100.35 21.67,99.81 30.91,99.81 37.85,106.75 37.85,107.46 37.31,107.99 LED11.3
N$12
  Top 0.152: LED13.1 14.2,85.23 13.84,85.59 13.84,95.01 20.78,101.95 21.49,101.95 22.02,101.41 LED12.3
N$13
  Top 0.152: LED13.3 15.44,86.12 20.6,80.97 20.6,70.65 21.13,70.12 LED14.1
N$14
  Top 0.152: LED14.3 22.38,71.01 36.42,85.06 LED15.1
N$15  (via drill 0.35)
  Top 0.152: R1.2 34.11,22.89 v33,24 | v31,26 31.93,26.93 LED1.1
  Bottom 0.152: v33,24 v31,26
N$16
  Top 0.152: R5.1 117.07,4.93 118.05,3.95 119.46,3.95 120.47,2.94 S3.3
N$19
  Top 0.152: IC4.6 108.25,107.9 R3.1
N$25  (via drill 0.35)
  Top 0.152: IC4.4 109,101.3 v109,101 | v112.47,107.71 113.35,108.59 R4.1
  Bottom 0.152: v109,101 112.47,104.47 v112.47,107.71

### Text on the board
tPlace: LU Player Tracker V2 | Player Count | Crux Prime | Ninjago Monastery | <- Aux World / Occupied | Nexus Tower | Portabello | Moonbase | Club Station Alpha | Robot City | Starbase 3001 | Deep Freeze | Nimbus Station | Forbidden Valley | Avant Gardens | Gnarled Forest | Pet Cove | The Venture Explorer | Boot | Reset
bPlace: JLCJLCJLCJLC